# EAGLE design rpr-v1 (EAGLE 7.3.0)
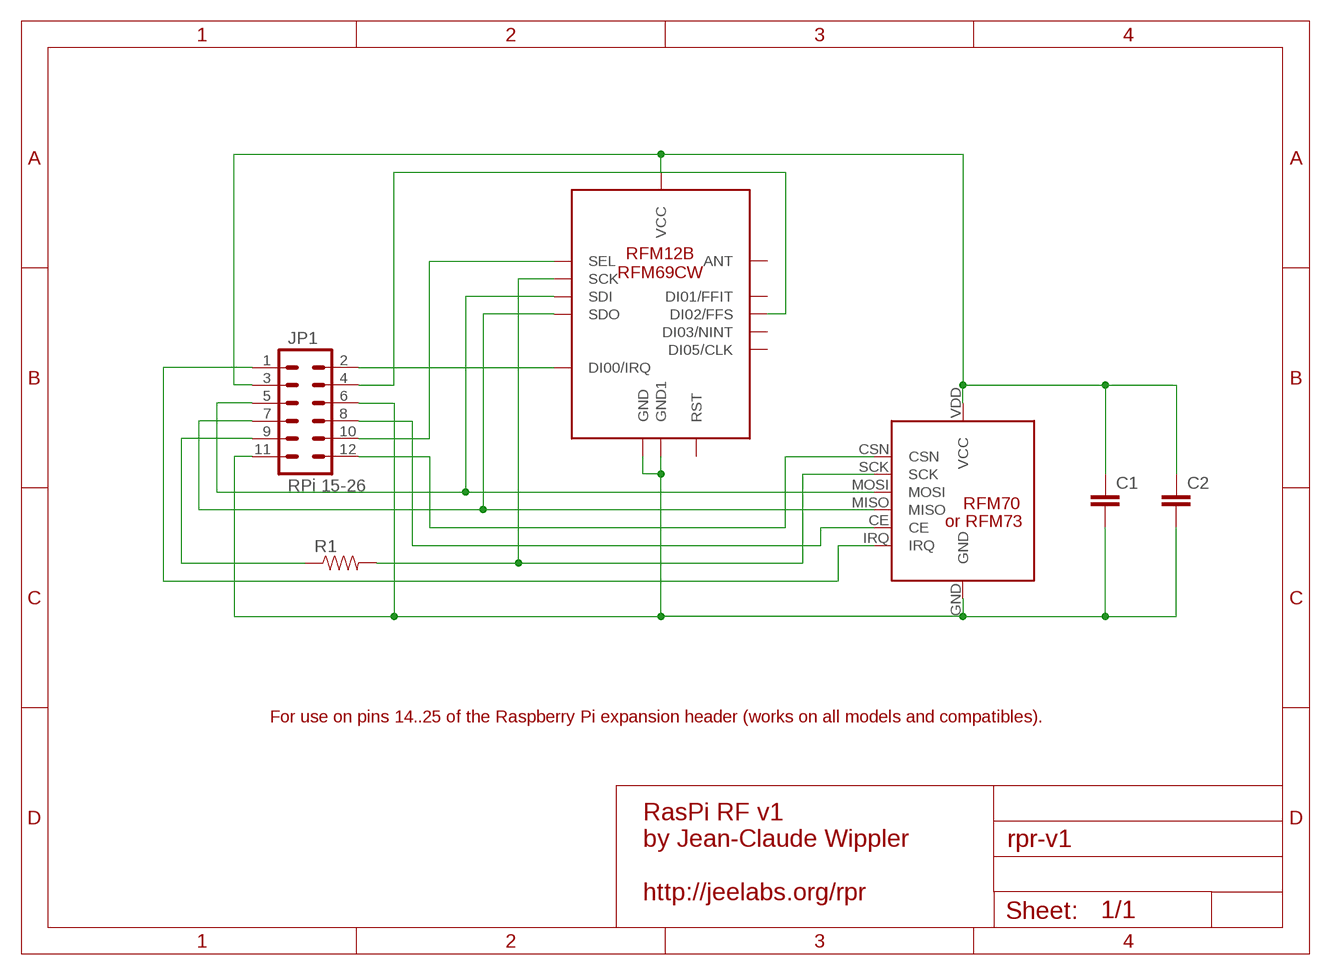
[diagram p0: schematic, sheet 1]

## Parts
C1  CAP0805  [0805]
C2  CAP0805  [0805]
JP1  RPi 15-26  M06X2PTH_FEMALE  [2X6]
R1  RESISTOR0603-RES  [0603-RES]
RFM12B/69CW  RFM12B/69CW  [RFM12B/69CW]
U$1  RFM70  [RFM70]

## Nets
GND: C1.2 C2.2 JP1.6 JP1.11 RFM12B/69CW.GND RFM12B/69CW.GND1 U$1.GND
N$2: C1.1 C2.1 JP1.3 RFM12B/69CW.VDD(VCC) U$1.VDD(VCC)
N$5: JP1.12 U$1.CSN
N$6: JP1.10 RFM12B/69CW.SEL
N$7: JP1.5 RFM12B/69CW.SDI U$1.MOSI
N$8: JP1.7 RFM12B/69CW.SDO U$1.MISO
N$9: JP1.9 R1.1
N$10: R1.2 RFM12B/69CW.SCK U$1.SCK
N$11: JP1.8 U$1.CE
N$12: JP1.1 U$1.IRQ
N$13: JP1.2 RFM12B/69CW.IRQ(DI00/IRQ)
N$14: JP1.4 RFM12B/69CW.FFS(DI02/FFS)
Unconnected: RFM12B/69CW.ANT RFM12B/69CW.CLK(DI05/CLK) RFM12B/69CW.FFIT(DI01/FFIT) RFM12B/69CW.NINT(DI03/NINT) RFM12B/69CW.RST

## Notes on the sheet
- or RFM73
- For use on pins 14..25 of the Raspberry Pi expansion header (works on all models and compatibles).
- RasPi RF v1
  by Jean-Claude Wippler
  
  http://jeelabs.org/rpr

## Library data of the parts
C1 C2 = SparkFun-Passives:CAP: Capacitor Standard 0603 ceramic capacitor, and 0.1" leaded capacitor.
JP1 = SparkFun-Connectors:M06X2; PROD_ID: CONN-12423; VALUE: 2X6 FEMALE
R1 = SparkFun-Passives:RESISTOR: Resistor Basic schematic elements and footprints for 0603, 1206, and PTH resistors.
RFM12B/69CW = Eagle-JeeLabs:RFM12B/69CW
U$1 = JeeLabs:RFM70

## Board
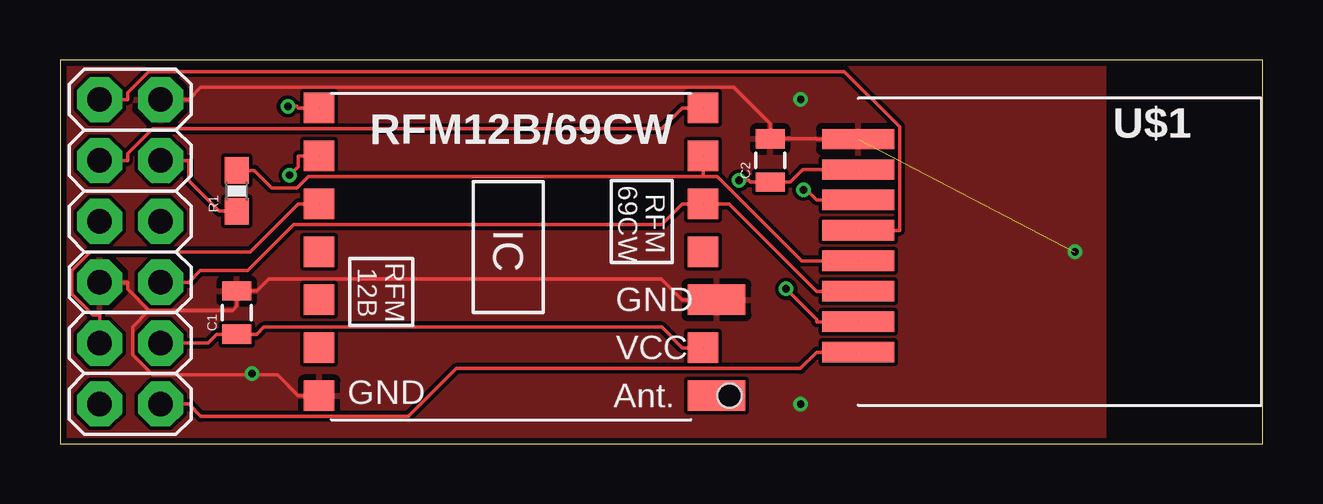
[diagram p1: board, top side]
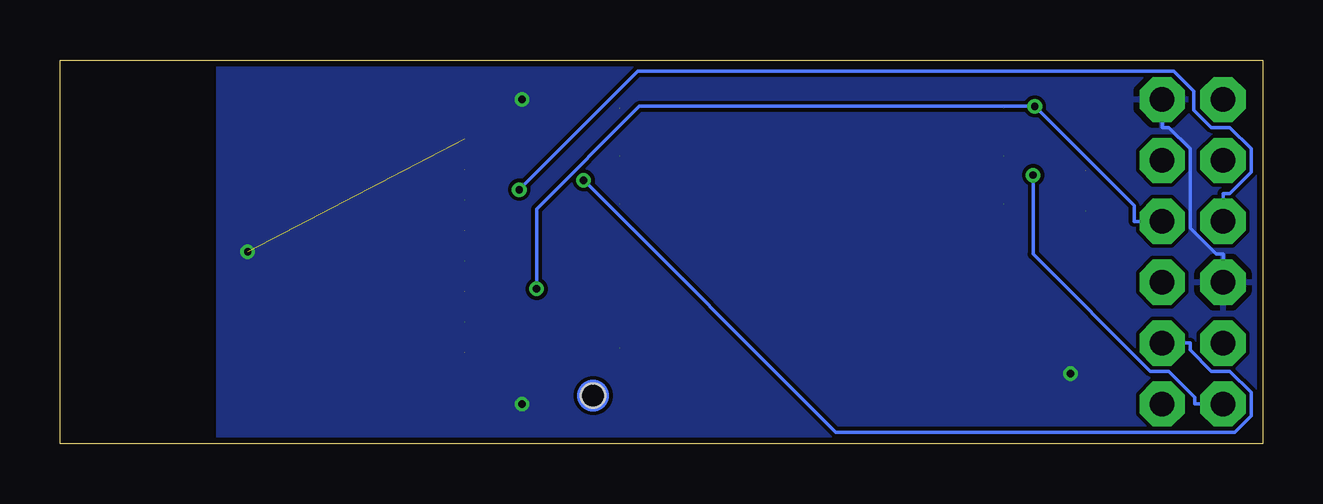
[diagram p2: board, bottom side, seen from below]

Size 50.11 x 16 mm. Coordinates in mm from the lower left corner, seen from the top.
Outline: 0,0 50.11,0 50.11,16 0,16 0,0
Copper layers (1*16): Top 0.035mm / dielectric 1.5mm / Bottom 0.035mm
Design rules "ITEADstudio_DRC": minimum track width 6mil, minimum drill 12mil, track to track 6mil, track to pad 6mil, pad to pad 6mil, via to via 6mil, smd to smd 0mil, copper to edge 10mil, drill to drill 10mil, minimum pad ring 10mil, minimum via ring 6mil, stop-mask expansion 2mil, vias tented up to drill 100mil, thermal gap 10mil

### Footprints (pad centres in the part's own frame; a part is rotated, then mirrored left to right if it is on the bottom)
0805 = smd 0.8 x 1.2: 1 -0.9,0; 2 0.9,0
2X6 = drill 1.016 pad 1.88 octagon: 1 0,0; 2 0,2.54; 3 2.54,0; 4 2.54,2.54; 5 5.08,0; 6 5.08,2.54; 7 7.62,0; 8 7.62,2.54; 9 10.16,0; 10 10.16,2.54; 11 12.7,0; 12 12.7,2.54
0603-RES = smd 1.1 x 1: 1 -0.85,0; 2 0.85,0
RFM12B/69CW = smd 2.413 x 1.27: ANT 8.56,-6; GND 8.56,-2 | smd 1.27 x 1.27: CLK -8,-2; FFIT -8,0; FFS -8,2; GND1 -8,-6; IRQ -8,4; NINT 8,0; RST -8,-4; SCK 8,4; SDI 8,2; SDO -8,6; SEL 8,6; VDD 8,-4 | hole 1: 9.1,-6
RFM70 = smd 3 x 0.85: CE -8.4,2.16; CSN -8.4,0.89; GND -8.4,4.7; IRQ -8.4,-4.19; MISO -8.4,-2.92; MOSI -8.4,-1.65; SCK -8.4,-0.38; VDD -8.4,3.43

### Placement (x,y rotation side)
C1  7.37,5.46 90 top
C2  29.59,11.81 90 top
JP1  4.19,1.65 90 top
R1  7.37,10.54 90 top
RFM12B/69CW  18.8,8 0 top
U$1  41.66,8 0 top

### Tracks (layer width: path | path; a pad name or v marks a point on that pad's centre or on a via)
GND  (via drill 0.3 pad 0.61)  (1 unrouted)
  Top 0.152: JP1.11 5.36,14.35 5.87,14.87 28.07,14.87 29.59,13.34 C2.2 31.52,12.71 31.53,12.7 U$1.GND | RFM12B/69CW.GND1 9.93,2 9.07,2.87 3.86,2.87 3.02,3.7 3.02,4.87 3.71,5.56 | 3.71,5.56 7.19,5.56 7.37,5.73 C1.2 8.2,6.36 8.7,6.86 25.06,6.86 25.92,6 RFM12B/69CW.GND | 3.71,5.56 2.82,6.45 2.82,6.73 JP1.6
  Bottom 0.152: JP1.6 1.65,7.9 1.94,7.9 3.02,8.98 3.02,12.3 3.91,13.18 4.19,13.18 JP1.11
  other vias: 8,2.92 30.86,1.65 30.86,14.35 42.29,8
  pour Bottom: -0.89,18.16 43.56,18.16 43.56,-2.16 -0.89,-2.16
  pour Top: -2.16,16.89 43.56,16.89 43.56,-0.89 -2.16,-0.89
N$2  (via drill 0.3 pad 0.61)  (2 unrouted)
  Top 0.152: JP1.3 6.17,4.19 6.54,4.56 C1.1 8.2,4.56 8.5,4.86 25.07,4.86 25.93,4 RFM12B/69CW.VDD | U$1.VDD 30.94,11.43 30.42,10.91 C2.1 28.76,10.91 28.69,10.98 v28.3,10.98
  Bottom 0.152: JP1.3 3.02,4.19 3.02,3.91 2.14,3.02 1.36,3.02 0.48,2.14 0.48,1.17 1.17,0.48 17.8,0.48 v28.3,10.98
N$5  (1 unrouted)
  Top 0.152: JP1.12 2.82,14.35 2.82,14.64 3.7,15.52 32.68,15.52 34.98,13.22 34.98,8.89 U$1.CSN
N$6  (1 unrouted)
  Top 0.152: RFM12B/69CW.SEL 25.93,14 25.07,13.14 3.86,13.14 2.82,12.09 2.82,11.81 JP1.10
N$7  (2 unrouted)
  Top 0.152: JP1.5 5.36,6.73 5.84,7.21 7.82,7.21 9.75,9.14 25.07,9.14 25.93,10 RFM12B/69CW.SDI 27.23,10 27.66,10 27.88,10 31.53,6.35 U$1.MOSI
N$8  (via drill 0.3 pad 0.61)  (2 unrouted)
  Top 0.152: U$1.MISO 31.53,5.08 31.53,5.18 v30.25,6.46 | RFM12B/69CW.SDO 9.93,14 9.87,14.07 v9.5,14.07
  Bottom 0.152: v30.25,6.46 30.25,9.78 25.97,14.07 v9.5,14.07 5.36,9.93 5.36,9.27 JP1.7
N$9  (1 unrouted)
  Top 0.152: JP1.9 5.36,11.81 5.36,10.97 6.64,9.69 R1.1
N$10  (3 unrouted)
  Top 0.152: R1.2 8.1,11.39 8.82,10.66 9.86,10.66 10.34,11.14 26.8,11.14 | 26.8,11.14 26.8,11.21 RFM12B/69CW.SCK | U$1.SCK 30.9,7.62 27.38,11.14 26.8,11.14
N$11  (via drill 0.3 pad 0.61)  (1 unrouted)
  Top 0.152: U$1.CE 31.53,10.16 31.1,10.59 v30.97,10.59
  Bottom 0.152: JP1.8 1.65,10.44 1.36,10.44 0.48,11.32 0.48,12.3 1.37,13.18 2.14,13.18 2.87,13.92 2.87,14.69 3.7,15.52 26.04,15.52 v30.97,10.59
N$12  (1 unrouted)
  Top 0.152: JP1.1 5.36,1.65 5.87,1.14 14.51,1.14 16.51,3.14 30.85,3.14 31.53,3.81 U$1.IRQ
N$13  (via drill 0.3 pad 0.61)  (1 unrouted)
  Top 0.152: RFM12B/69CW.IRQ 9.93,12 9.93,11.56 v9.57,11.2
  Bottom 0.152: JP1.2 2.82,1.65 2.82,1.94 3.9,3.02 4.68,3.02 9.57,7.91 v9.57,11.2
N$14  (1 unrouted)
  Top 0.152: JP1.4 1.65,5.36 1.36,5.36 0.48,6.24 0.48,7.22 1.26,8 7.93,8 9.93,10 RFM12B/69CW.FFS